# Altium schematic sheet 18.SchDoc
size 297 x 209 mm
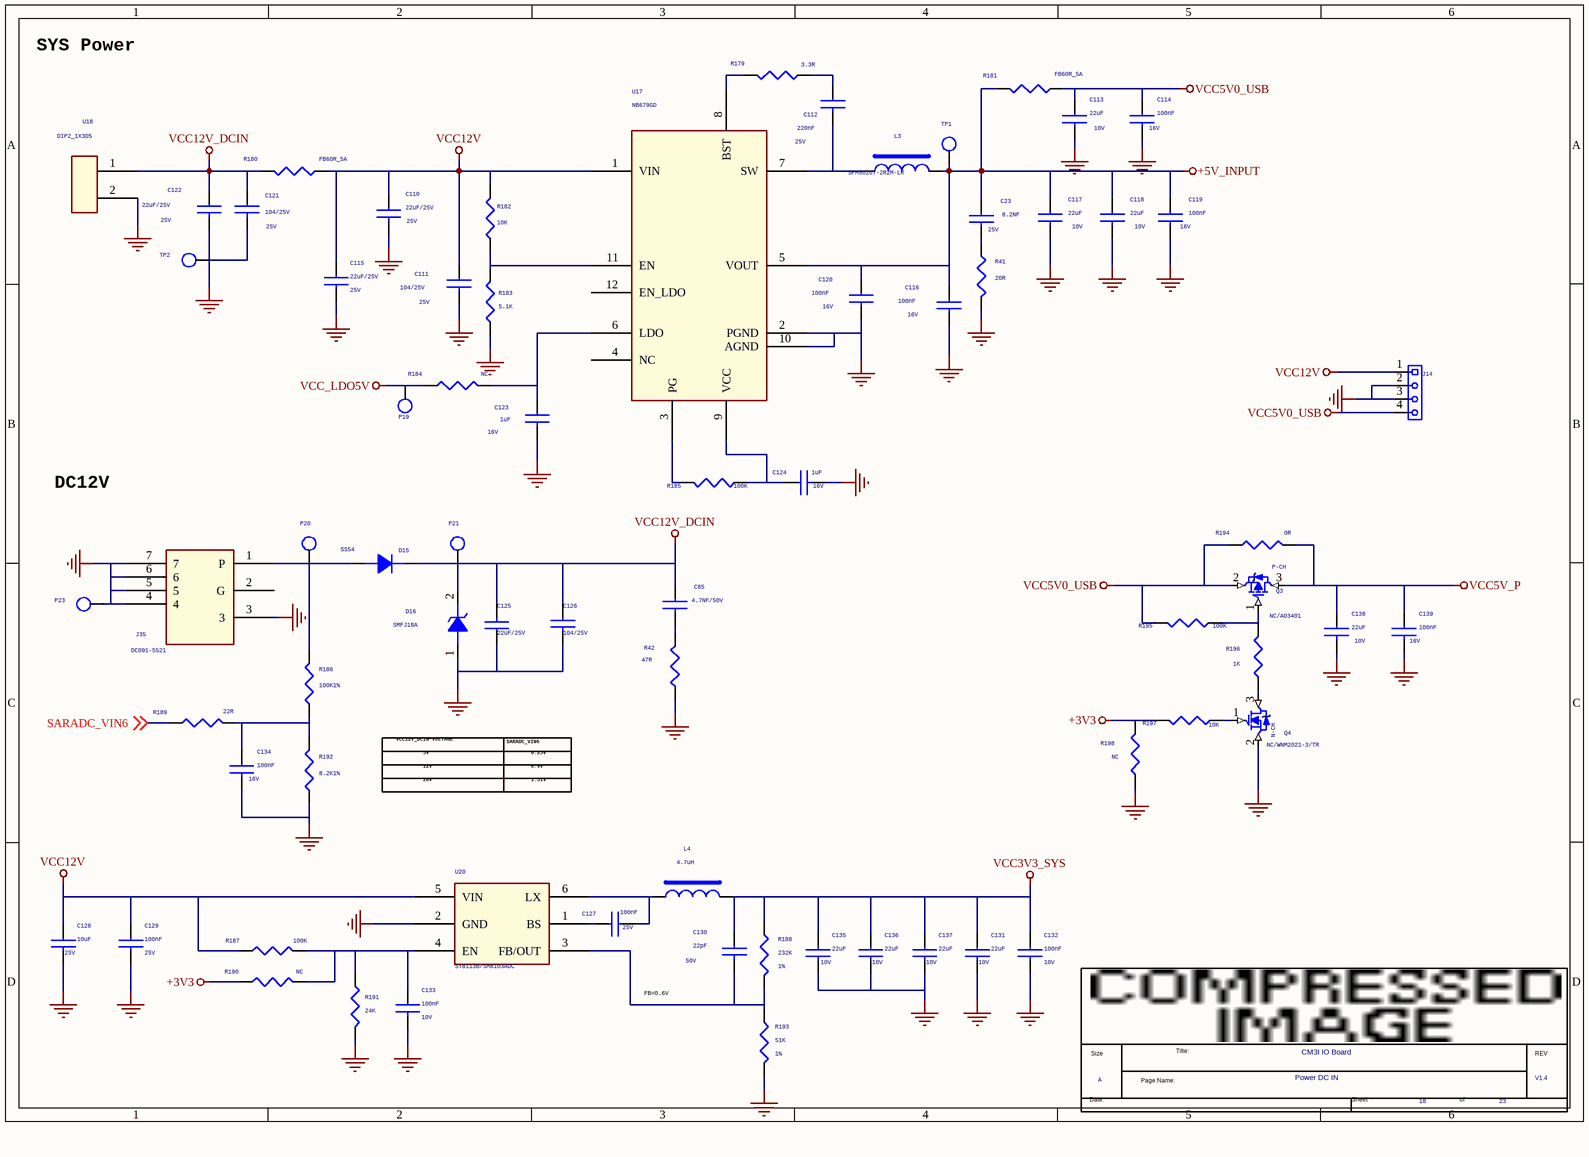
[diagram p0: 18.SchDoc]

## Parts
*  Page Count: 23  Page Number: 18  Page Size: A  Title: CM3I IO Board  RevCode: V1.4  Doc: Power DC IN  (hidden comment: radxa_1010)  (graphical)
C23  8.2NF  Voltage: 25V  [C0402]
C85  4.7NF/50V  [C0603]
C110  22uF/25V  Voltage: 25V  [C0805]
C111  104/25V  Voltage: 25V  [C0402]
C112  220nF  Voltage: 25V  [C0402]
C113  22uF  Voltage: 10V  [C0603]
C114  100nF  Voltage: 16V  [C0402]
C115  22uF/25V  Voltage: 25V  [C0805]
C116  100nF  Voltage: 16V  [C0402]
C117  22uF  Voltage: 10V  [C0603]
C118  22uF  Voltage: 10V  [C0603]
C119  100nF  Voltage: 16V  [C0402]
C120  100nF  Voltage: 16V  [C0402]
C121  104/25V  Voltage: 25V  [C0402]
C122  22uF/25V  Voltage: 25V  [C0805]
C123  1uF  Voltage: 16V  [C0402]
C124  1uF  Voltage: 16V  [C0402]
C125  22uF/25V  [C0805]
C126  104/25V  [C0402]
C127  100nF  Voltage: 25V  [C0402]
C128  10uF  Voltage: 25V  [C1206]
C129  100nF  Voltage: 25V  [C0402]
C130  22pF  Voltage: 50V  [C0402]
C131  22uF  Voltage: 10V  [C0805]
C132  100nF  Voltage: 10V  [C0402]
C133  100nF  Voltage: 10V  [C0402]
C134  100nF  Voltage: 16V  [C0402]
C135  22uF  Voltage: 10V  [C0805]
C136  22uF  Voltage: 10V  [C0805]
C137  22uF  Voltage: 10V  [C0805]
C138  22uF  Voltage: 10V  [C0603]
C139  100nF  Voltage: 16V  [C0402]
D15  SS54  [DO_214AC]
D16  SMFJ18A  [SOD_123]
J14  HEADER_1X4P  [header_1x4]  (value not drawn)
J35  DC091-5521  [DC091-5521]
L3  SPM5020T-2R2M-LR  [IND-5020]
L4  4.7uH  [IND-4X4]
P19  TEST  [TEST]  (value not drawn)
P20  TEST  [TEST]  (value not drawn)
P21  TEST  [TEST]  (value not drawn)
P23  TEST  [TEST]  (value not drawn)
Q3  NC/AO3401  [S0T-23]
Q4  NC/WNM2021-3/TR  [S0T-23]
R41  20R  [R0402]
R42  47R  [R0402]
R179  3.3R  [R0402]
R180  FB60R_5A  [R1206]
R181  FB60R_5A  [R1206]
R182  10K  [R0402]
R183  5.1K  [R0402]
R184  NC  [R0402]
R185  100K  [R0402]
R186  100K1%  [R0402]
R187  100K  [R0402]
R188  232K  Tolerance: 1%  [R0402]
R189  22R  [R0402]
R190  NC  [R0402]
R191  24K  [R0402]
R192  8.2K1%  [R0402]
R193  51K  Tolerance: 1%  [R0402]
R194  0R  [R0603]
R195  100K  [R0402]
R196  1K  [R0402]
R197  10K  [R0402]
R198  NC  [R0402]
TP1  TP_0.7  [TEST]  (value not drawn)
TP2  TP_0.7  [TEST]  (value not drawn)
U17  NB679GD  [QFN12_3R00X2R00X0R90]
U18  DIP2_1X3D5  [DIP2_1X3D5]
U20  SY8113B/SM8103ADC  [SOT_23_6]

## Nets
+3V3: R190.1 R197.2 R198.1
+5V_INPUT: C23.1 C116.1 C117.1 C118.1 C119.1 C120.1 L3.2 R181.2 TP1.1 U17.5(VOUT)
GND: C110.2 C111.2 C113.2 C114.2 C115.2 C116.2 C117.2 C118.2 C119.2 C120.2 C121.2 C122.2 C123.2 C124.2 C125.1 C126.2 C128.2 C129.2 C131.2 C132.2 C133.2 C134.2 C135.2 C136.2 C137.2 C138.2 C139.2 D16.1(ANODE) J14.2 J14.3 J35.3 J35.4 J35.5 J35.6 J35.7 P23.1 Q4.2(S) R41.2 R42.1 R183.1 R191.2 R192.1 R193.2 R198.2 TP2.1 U17.2(PGND) U17.10(AGND) U18.2 U20.2(GND)
VCC3V3_SYS: C130.1 C131.1 C132.1 C135.1 C136.1 C137.1 L4.2 R188.1
VCC5V0_USB: C113.1 C114.1 J14.4 Q3.2(S) R181.1 R194.2 R195.2
VCC5V_P: C138.1 C139.1 Q3.3(D) R194.1
VCC12V: C110.1 C111.1 C115.1 C128.1 C129.1 J14.1 R180.1 R182.2 R187.1 U17.1(VIN) U20.5(VIN)
VCC12V_DCIN: C85.1 C121.1 C122.1 C125.2 C126.1 D15.2(K) D16.2(CATHODE) P21.1 R180.2 U18.1
VCC_LDO5V: P19.1 R184.1
SARADC_VIN6: R189.1 ; off-sheet SARADC_VIN6
NetC23_2: C23.2 R41.1
NetC85_2: C85.2 R42.2
NetC112_1: C112.1 R179.2
NetC112_2: C112.2 L3.1 U17.7(SW)
NetC123_1: C123.1 R184.2 U17.6(LDO)
NetC124_1: C124.1 R185.2 U17.9(VCC)
NetC127_1: C127.1 U20.1(BS)
NetC127_2: C127.2 L4.1 U20.6(LX)
NetC130_2: C130.2 R188.2 R193.1 U20.3(FB/OUT)
NetC133_1: C133.1 R187.2 R190.2 R191.1 U20.4(EN)
NetC134_1: C134.1 R186.1 R189.2 R192.2
NetD15_1: D15.1(A) J35.1(P) P20.1 R186.2
NetQ3_1: Q3.1(G) R195.1 R196.1
NetQ4_1: Q4.1(G) R197.1
NetQ4_3: Q4.3(D) R196.2
NetR179_1: R179.1 U17.8(BST)
NetR182_1: R182.1 R183.2 U17.11(EN)
NetR185_1: R185.1 U17.3(PG)

Not connected (* = marked no-connect by the designer): J35 2(G); U17 4(NC) 12(EN_LDO)

## Notes on the sheet
- SYS Power
- DC12V
- VCC12V_DCIN-VOLTAGE
- SARADC_VIN6
- 5V
- 12V
- 20V
- 0.25V
- 1.51V
- 0.9V
- FB=0.6V
- (in symbol N-MOSFET) N-CH
- (in symbol P-MOSFET) P-CH
- (in symbol radxa_1010) Title:; Size; REV; Page Name:; Date:; Sheet; of

## Library data of the parts
C23 = CAP NP_0_Dup1: cap,100.00nF,+/-10%,16V,X5R,C0402; Manufacturer PN: C1005X5R1C104K050BA; Manufacturer: TDK; Tolerance: 10%; Priority: A; Dielectric: X5R; Created by: JJJ; Part Type: C0402; RK PN: C1005X5R1C104K050BA
C85 = CAP NP_0_Dup1: Priority: A
C110 C122 = CAP NP_0: cap,10.00uF,+/-10%,16V,X5R,C0805; Manufacturer: TDK; RK PN: C2012X5R1C106K125AC; Priority: A; Tolerance: 10%; Dielectric: X5R; Part Type: C0805; Manufacturer PN: C2012X5R1C106K125AC; Created by: JJJ
C111 C123 = CAP NP_0: cap,1.00uF,+/-10%,16V,X5R,C0402; Manufacturer: TDK; RK PN: C1005X5R1C105K050BC; Priority: A; Tolerance: 10%; Dielectric: X5R; Part Type: C0402; Manufacturer PN: C1005X5R1C105K050BC; Created by: JJJ
C112 = CAP NP_0: cap,220.00nF,+/-10%,25V,X5R,C0402; Manufacturer PN: C1005X5R1E224K050BC; Manufacturer: TDK; Tolerance: 10%; Priority: A; Dielectric: X5R; Created by: JJJ; Part Type: C0402; RK PN: C1005X5R1E224K050BC
C113 C117 C118 C138 = CAP NP_0: cap,22.00uF,+/-10%,10V,X5R,C0805; Manufacturer PN: C2012X5R1A226K125AB; Manufacturer: TDK; Tolerance: 10%; Priority: A; Dielectric: X5R; Created by: JJJ; Part Type: C0805; RK PN: C2012X5R1A226K125AB
C114 C119 = CAP NP_0: cap,100.00nF,+/-10%,16V,X5R,C0402; Manufacturer: TDK; RK PN: C1005X5R1C104K050BA; Priority: A; Tolerance: 10%; Dielectric: X5R; Part Type: C0402; Manufacturer PN: C1005X5R1C104K050BA; Created by: JJJ
C115 = CAP NP_0: cap,10.00uF,+/-10%,16V,X5R,C0805; Manufacturer PN: C2012X5R1C106K125AC; Manufacturer: TDK; Tolerance: 10%; Priority: A; Dielectric: X5R; Created by: JJJ; Part Type: C0805; RK PN: C2012X5R1C106K125AC
C116 C120 C134 C139 = CAP NP_0: cap,100.00nF,+/-10%,16V,X5R,C0402; Manufacturer PN: C1005X5R1C104K050BA; Manufacturer: TDK; Tolerance: 10%; Priority: A; Dielectric: X5R; Created by: JJJ; Part Type: C0402; RK PN: C1005X5R1C104K050BA
C121 C124 = CAP NP_0: cap,1.00uF,+/-10%,16V,X5R,C0402; Manufacturer PN: C1005X5R1C105K050BC; Manufacturer: TDK; Tolerance: 10%; Priority: A; Dielectric: X5R; Created by: JJJ; Part Type: C0402; RK PN: C1005X5R1C105K050BC
C125 = CAP NP_4
C126 = CAP NP_Dup3: CAP,MLCC,1nF,+/-10%,X5R,6.3V,SMD0402; MARK: 22P; ROOM: USB+5V
C127 = CAP NP_0: cap,100.00nF,+/-10%,25V,X5R,C0402; Manufacturer: TDK; Number: 37; RK PN: C1005X5R1E104K050BC; Priority: A; Tolerance: 10%; C_Voltage: 6.3V; Dielectric: X5R; Part Type: C0402; Manufacturer PN: C1005X5R1E104K050BC; Created by: JJJ
C128 = CAP NP_0: cap,10.00uF,+/-10%,25V,X5R,C1206; Manufacturer: TDK; RK PN: C3216X5R1E106K085AC; Priority: A; C_Voltage: 6.3V; Tolerance: 10%; Dielectric: X5R; Part Type: C1206; Manufacturer PN: C3216X5R1E106K085AC; Created by: JJJ
C129 = CAP NP_0: cap,100.00nF,+/-10%,25V,X5R,C0402; Manufacturer PN: C1005X5R1E104K050BC; Manufacturer: TDK; Tolerance: 10%; Priority: A; Dielectric: X5R; Created by: JJJ; Part Type: C0402; RK PN: C1005X5R1E104K050BC
C130 = CAP NP_0: cap,22.00pF,+/-5%,50V,C0G,C0402; Manufacturer: TDK; RK PN: C1005C0G1H220J050BA; Priority: A; Tolerance: 5%; Dielectric: C0G; Part Type: C0402; Manufacturer PN: C1005C0G1H220J050BA; Created by: JJJ
C131 C136 = CAP NP_0: cap,22.00uF,+/-10%,10V,X5R,C0805; Manufacturer: TDK; RK PN: C2012X5R1A226K125AB; Priority: A; C_Voltage: 6.3V; Tolerance: 10%; Dielectric: X5R; Part Type: C0805; Manufacturer PN: C2012X5R1A226K125AB; Created by: JJJ
C132 = CAP NP_0: cap,100.00nF,+/-10%,10V,X5R,C0402; Manufacturer PN: C1005X5R1A104K050BA; Manufacturer: TDK; C_Voltage: 6.3V; Tolerance: 10%; Priority: A; Number: 37; Dielectric: X5R; Created by: JJJ; Part Type: C0402; RK PN: C1005X5R1A104K050BA
C133 = CAP NP_0: cap,100.00nF,+/-10%,10V,X5R,C0402; Manufacturer: TDK; Number: 37; RK PN: C1005X5R1A104K050BA; Priority: A; Tolerance: 10%; C_Voltage: 6.3V; Dielectric: X5R; Part Type: C0402; Manufacturer PN: C1005X5R1A104K050BA; Created by: JJJ
C135 C137 = CAP NP_0: cap,22.00uF,+/-10%,10V,X5R,C0805; Manufacturer PN: C2012X5R1A226K125AB; Manufacturer: TDK; Tolerance: 10%; C_Voltage: 6.3V; Priority: A; Dielectric: X5R; Created by: JJJ; Part Type: C0805; RK PN: C2012X5R1A226K125AB
D15 = DIODE_Dup1: Schottky Barrier，SS32 DO214AC; Manufacturer: 星海; ROOM: CHG; RK PN: SS32; Priority: A; Part Type: Schottky rectifier; Manufacturer PN: SS32; Created by: JJJ
D16 = DIODE ZENER1: 1-Line, Uni-directional, Transient Voltage Suppressor; Manufacturer: WillSemi(韦尔半导体); RK PN: ESD5621W-2/TR; Priority: A; Part Type: ESD_TVS; Manufacturer PN: ESD5621W-2/TR; Created by: JJJ
J14 = HEADER_1X4P: PINREX/210-91-04GB01       <G>; Critical_Part: N; Manufacture: PINREX; Part Number: 12G06000004P; Device: hd_1x4p_100_pinrex_lf3; Symbol_pic: K:\Symbol_Pic\12-CONNECTOR\12G06000004P_MID.zip; metal_fabrication: 00000011; Class: IO; FPLIST: hd_1x4p_100_pinrex_lf3,mb_hd_1x4p_100_lf3; Data_Sheet: K:\DataSheet\12-CONNECTOR\12G06000004P.pdf; Sourcer: 法醇稻(X17175); Electric_SPE: BLACK; Component_Name: HEADER 1X4P S/T 2.54mm G/F; Colay_Alternate: N/A; Colay_Group: N/A; Subsystem_ID: N/A; Optional: N/A; Modify_Data: 2007/8/2; Database_Update: 2007/4/17; Part Type: 12CONNECTOR\HEADER; Package_Type: DIP; Status: All 某纔舦0005
L3 = INDUCTORS OF FERRITE
L4 = INDUCTORS OF FERRITE_Dup1: Power Inductor,4.7uH,0.2,IND_606045; Manufacturer: sunlord; DC Resistor: 0.02ohm; Isat: 4.97A; RK PN: SWPA6045S4R7MT; Priority: A; Tolerance: 20%; Irms: 3.3A; Resonace frequency: 24M; Part Type: POWER_IND; Manufacturer PN: SWPA6045S4R7MT; Created by: YWQ
P19-P21 P23 = TESTPOINT1
Q3 = P-MOSFET: SANZ_P/N: SK2301; Part Type: MOS管
Q4 = N-MOSFET: SANZ_P/N: SK2300; Part Type: MOS管
R41 = RESISTOR_0_Dup2: 通用厚膜电阻,47K,+/-5%,R0402,1/16W.; Manufacturer PN: RC0402JR-0747KL; Manufacturer: YAGEO; Tolerance: 5%; Wattage: 1/16W; Priority: A; Created by: YTL; Part Type: 通用厚膜电阻; RK PN: RC0402JR-0747KL
R42 = RESISTOR_0_Dup2: 通用厚膜电阻,330R,+/-5%,R0402,1/16W.; Manufacturer PN: RC0402JR-07330RL; Manufacturer: YAGEO; Tolerance: 5%; Wattage: 1/16W; Priority: A; Created by: YTL; Part Type: 通用厚膜电阻; RK PN: RC0402JR-07330RL
R179 = RESISTOR_0_Dup1: 通用厚膜电阻,3R3,+/-5%,R0402,1/16W.; Manufacturer PN: RC0402JR-073R3L; Manufacturer: YAGEO; Tolerance: 5%; Wattage: 1/16W; Priority: A; Created by: YTL; Part Type: 通用厚膜电阻; RK PN: RC0402JR-073R3L
R180 R181 = R_0
R182 = RESISTOR_0_Dup1: 通用厚膜电阻,10K,+/-5%,R0402,1/16W.; Manufacturer PN: RC0402JR-0710KL; Manufacturer: YAGEO; Tolerance: 5%; Wattage: 1/16W; Priority: A; Created by: YTL; Part Type: 通用厚膜电阻; RK PN: RC0402JR-0710KL
R183 = RESISTOR_0_Dup1: 通用厚膜电阻,10K,+/-5%,R0402,1/16W.; Manufacturer: YAGEO; Tolerance: 5%; RK PN: RC0402JR-0710KL; Priority: A; Wattage: 1/16W; Part Type: 通用厚膜电阻; Manufacturer PN: RC0402JR-0710KL; Created by: YTL
R184 = RESISTOR_2_Dup1: 通用厚膜电阻,10K,+/-5%,R0402,1/16W.; Manufacturer PN: RC0402JR-0710KL; Manufacturer: YAGEO; Tolerance: 5%; Wattage: 1/16W; Priority: A; Created by: YTL; Part Type: 通用厚膜电阻; RK PN: RC0402JR-0710KL
R185 R190 = RESISTOR_0_Dup1: 通用厚膜电阻,100K,+/-5%,R0402,1/16W.; Manufacturer: YAGEO; Tolerance: 5%; RK PN: RC0402JR-07100KL; Priority: A; Wattage: 1/16W; Part Type: 通用厚膜电阻; Manufacturer PN: RC0402JR-07100KL; Created by: YTL
R186 R189 R192 = RESISTOR_2_Dup1: 通用厚膜电阻,10K,+/-5%,R0402,1/16W.; Manufacturer: YAGEO; Tolerance: 5%; RK PN: RC0402JR-0710KL; Priority: A; Wattage: 1/16W; Part Type: 通用厚膜电阻; Manufacturer PN: RC0402JR-0710KL; Created by: YTL
R187 = RESISTOR_0_Dup1: 通用厚膜电阻,100K,+/-5%,R0402,1/16W.; Manufacturer PN: RC0402JR-07100KL; Manufacturer: YAGEO; Tolerance: 5%; Wattage: 1/16W; Priority: A; Created by: YTL; Part Type: 通用厚膜电阻; RK PN: RC0402JR-07100KL
R188 = RESISTOR_0_Dup1: 通用厚膜电阻,232K,+/-1%,R0402,1/16W.; Manufacturer PN: RC0402FR-07232KL; Manufacturer: YAGEO; Wattage: 1/16W; Priority: A; Created by: YTL; Part Type: 通用厚膜电阻; RK PN: RC0402FR-07232KL
R191 = RESISTOR_0_Dup1: 通用厚膜电阻,24K,+/-5%,R0402,1/16W.; Manufacturer: YAGEO; Tolerance: 5%; RK PN: RC0402JR-0724KL; Priority: A; Wattage: 1/16W; Part Type: 通用厚膜电阻; Manufacturer PN: RC0402JR-0724KL; Created by: YTL
R193 = RESISTOR_0_Dup1: 通用厚膜电阻,49K9,+/-1%,R0402,1/16W.; Manufacturer PN: RC0402FR-0749K9L; Manufacturer: YAGEO; Wattage: 1/16W; Priority: A; Created by: YTL; Part Type: 通用厚膜电阻; RK PN: RC0402FR-0749K9L
R194 R195 R197 = RESISTOR_1_Dup1: RES,thick film,47KOhm,+/-5%,1/16W,SMD0402
R196 R198 = RESISTOR_0_Dup6: RES,thick film,47KOhm,+/-5%,1/16W,SMD0402; MARK: 51K
TP1 TP2 = TP: Test Point 0.7mm; RK PN: TESTPOINT_0R7; Priority: A; Part Type: TP; Created by: JJJ
U17 = DCDC_NB679: 26 V, Low Iq, High Current, Fixed 5 V-8 A Synchronous Buck Converter with 100 mA LDO;; Manufacturer: MPS （美国芯源）; Created by: JJJ; Manufacturer PN: NB679GD; Part Type: DCDC; Priority: A; RK PN: NB679GD
U18 = CON3_7
U20 = DCDC_SY8113: Manufacturer: Silergy（矽力杰）; Priority: A; RK PN: SY8113B; Part Type: DCDC; Manufacturer PN: SY8113B; Created by: JJJ
* = radxa_1010: Page Create Date: March  8, 1995